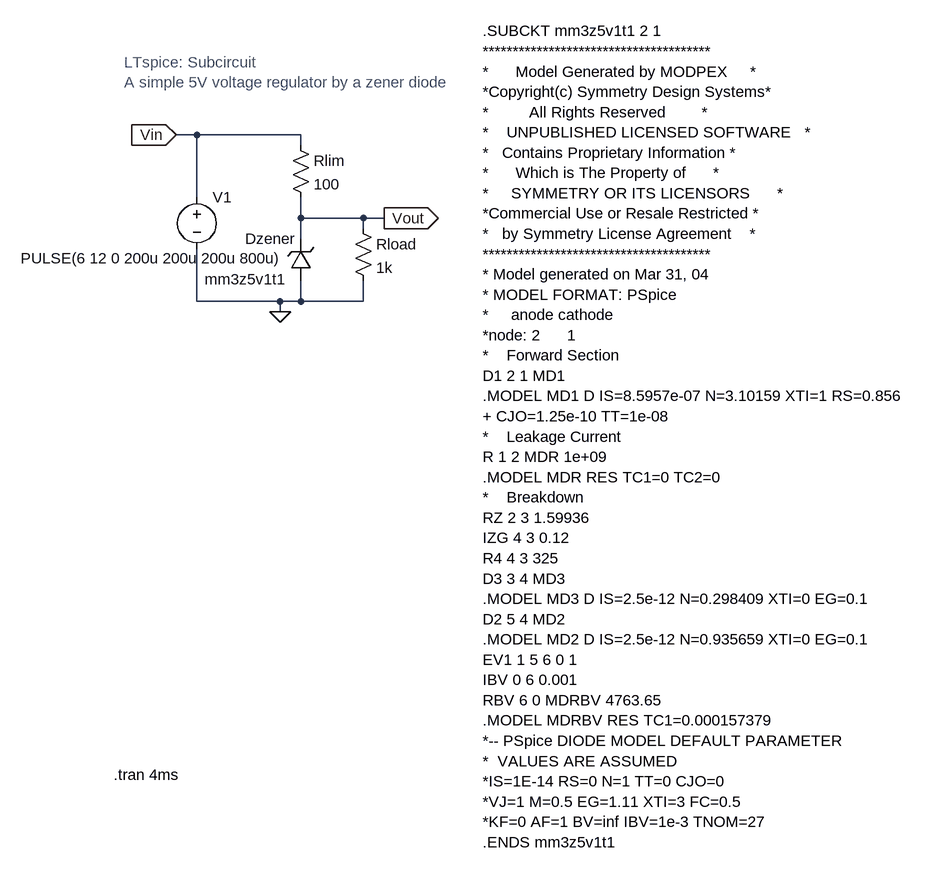
[diagram p0: schematic LTspice 06-2 Subcircuit_model_SPICE directive.asc]
LTspice 06-2 Subcircuit_model_SPICE directive.asc, the LTspice schematic file:
Version 4
SHEET 1 2152 1224
WIRE 368 192 336 192
WIRE 528 192 368 192
WIRE 528 208 528 192
WIRE 368 288 368 192
WIRE 528 320 528 288
WIRE 624 320 528 320
WIRE 656 320 624 320
WIRE 624 336 624 320
WIRE 528 352 528 320
WIRE 368 448 368 368
WIRE 496 448 368 448
WIRE 528 448 528 416
WIRE 528 448 496 448
WIRE 624 448 624 416
WIRE 624 448 528 448
WIRE 496 464 496 448
FLAG 496 464 0
FLAG 656 320 Vout
IOPIN 656 320 Out
FLAG 336 192 Vin
IOPIN 336 192 In
SYMBOL res 512 192 R0
SYMATTR InstName Rlim
SYMATTR Value 100
SYMBOL voltage 368 272 R0
WINDOW 3 -271 110 Left 2
WINDOW 123 0 0 Left 2
WINDOW 39 0 0 Left 2
SYMATTR Value PULSE(6 12 0 200u 200u 200u 800u)
SYMATTR InstName V1
SYMBOL res 608 320 R0
SYMATTR InstName Rload
SYMATTR Value 1k
SYMBOL zener 544 416 R180
WINDOW 0 24 64 Left 2
WINDOW 3 39 2 Left 2
SYMATTR InstName Dzener
SYMATTR Value mm3z5v1t1
SYMATTR Prefix X
TEXT 256 80 Left 2 ;LTspice: Subcircuit\nA simple 5V voltage regulator by a zener diode
TEXT 808 32 Left 2 !.SUBCKT mm3z5v1t1 2 1\n**************************************\n*      Model Generated by MODPEX     *\n*Copyright(c) Symmetry Design Systems*\n*         All Rights Reserved        *\n*    UNPUBLISHED LICENSED SOFTWARE   *\n*   Contains Proprietary Information *\n*      Which is The Property of      *\n*     SYMMETRY OR ITS LICENSORS      *\n*Commercial Use or Resale Restricted *\n*   by Symmetry License Agreement    *\n**************************************\n* Model generated on Mar 31, 04\n* MODEL FORMAT: PSpice\n*     anode cathode\n*node: 2      1\n*    Forward Section\nD1 2 1 MD1\n.MODEL MD1 D IS=8.5957e-07 N=3.10159 XTI=1 RS=0.856\n+ CJO=1.25e-10 TT=1e-08\n*    Leakage Current\nR 1 2 MDR 1e+09 \n.MODEL MDR RES TC1=0 TC2=0\n*    Breakdown\nRZ 2 3 1.59936\nIZG 4 3 0.12\nR4 4 3 325\nD3 3 4 MD3\n.MODEL MD3 D IS=2.5e-12 N=0.298409 XTI=0 EG=0.1\nD2 5 4 MD2\n.MODEL MD2 D IS=2.5e-12 N=0.935659 XTI=0 EG=0.1\nEV1 1 5 6 0 1\nIBV 0 6 0.001\nRBV 6 0 MDRBV 4763.65\n.MODEL MDRBV RES TC1=0.000157379\n*-- PSpice DIODE MODEL DEFAULT PARAMETER\n*  VALUES ARE ASSUMED\n*IS=1E-14 RS=0 N=1 TT=0 CJO=0\n*VJ=1 M=0.5 EG=1.11 XTI=3 FC=0.5\n*KF=0 AF=1 BV=inf IBV=1e-3 TNOM=27\n.ENDS mm3z5v1t1
TEXT 240 1176 Left 2 !.tran 4ms

The netlist it stands for:
* LTspice 06-2 Subcircuit_model_SPICE directive.asc
Rlim Vin Vout 100
V1 Vin 0 PULSE(6 12 0 200u 200u 200u 800u)
Rload Vout 0 1k
XDzener 0 Vout mm3z5v1t1  ; pins + -
* LTspice: Subcircuit
* A simple 5V voltage regulator by a zener diode
.SUBCKT mm3z5v1t1 2 1
**************************************
*      Model Generated by MODPEX     *
*Copyright(c) Symmetry Design Systems*
*         All Rights Reserved        *
*    UNPUBLISHED LICENSED SOFTWARE   *
*   Contains Proprietary Information *
*      Which is The Property of      *
*     SYMMETRY OR ITS LICENSORS      *
*Commercial Use or Resale Restricted *
*   by Symmetry License Agreement    *
**************************************
* Model generated on Mar 31, 04
* MODEL FORMAT: PSpice
*     anode cathode
*node: 2      1
*    Forward Section
D1 2 1 MD1
.MODEL MD1 D IS=8.5957e-07 N=3.10159 XTI=1 RS=0.856
+ CJO=1.25e-10 TT=1e-08
*    Leakage Current
R 1 2 MDR 1e+09
.MODEL MDR RES TC1=0 TC2=0
*    Breakdown
RZ 2 3 1.59936
IZG 4 3 0.12
R4 4 3 325
D3 3 4 MD3
.MODEL MD3 D IS=2.5e-12 N=0.298409 XTI=0 EG=0.1
D2 5 4 MD2
.MODEL MD2 D IS=2.5e-12 N=0.935659 XTI=0 EG=0.1
EV1 1 5 6 0 1
IBV 0 6 0.001
RBV 6 0 MDRBV 4763.65
.MODEL MDRBV RES TC1=0.000157379
*-- PSpice DIODE MODEL DEFAULT PARAMETER
*  VALUES ARE ASSUMED
*IS=1E-14 RS=0 N=1 TT=0 CJO=0
*VJ=1 M=0.5 EG=1.11 XTI=3 FC=0.5
*KF=0 AF=1 BV=inf IBV=1e-3 TNOM=27
.ENDS mm3z5v1t1
.tran 4ms
.backanno
.end